# EAGLE design echidna-v0.81 (EAGLE 9.6.2)

## Sheet 1 of 2
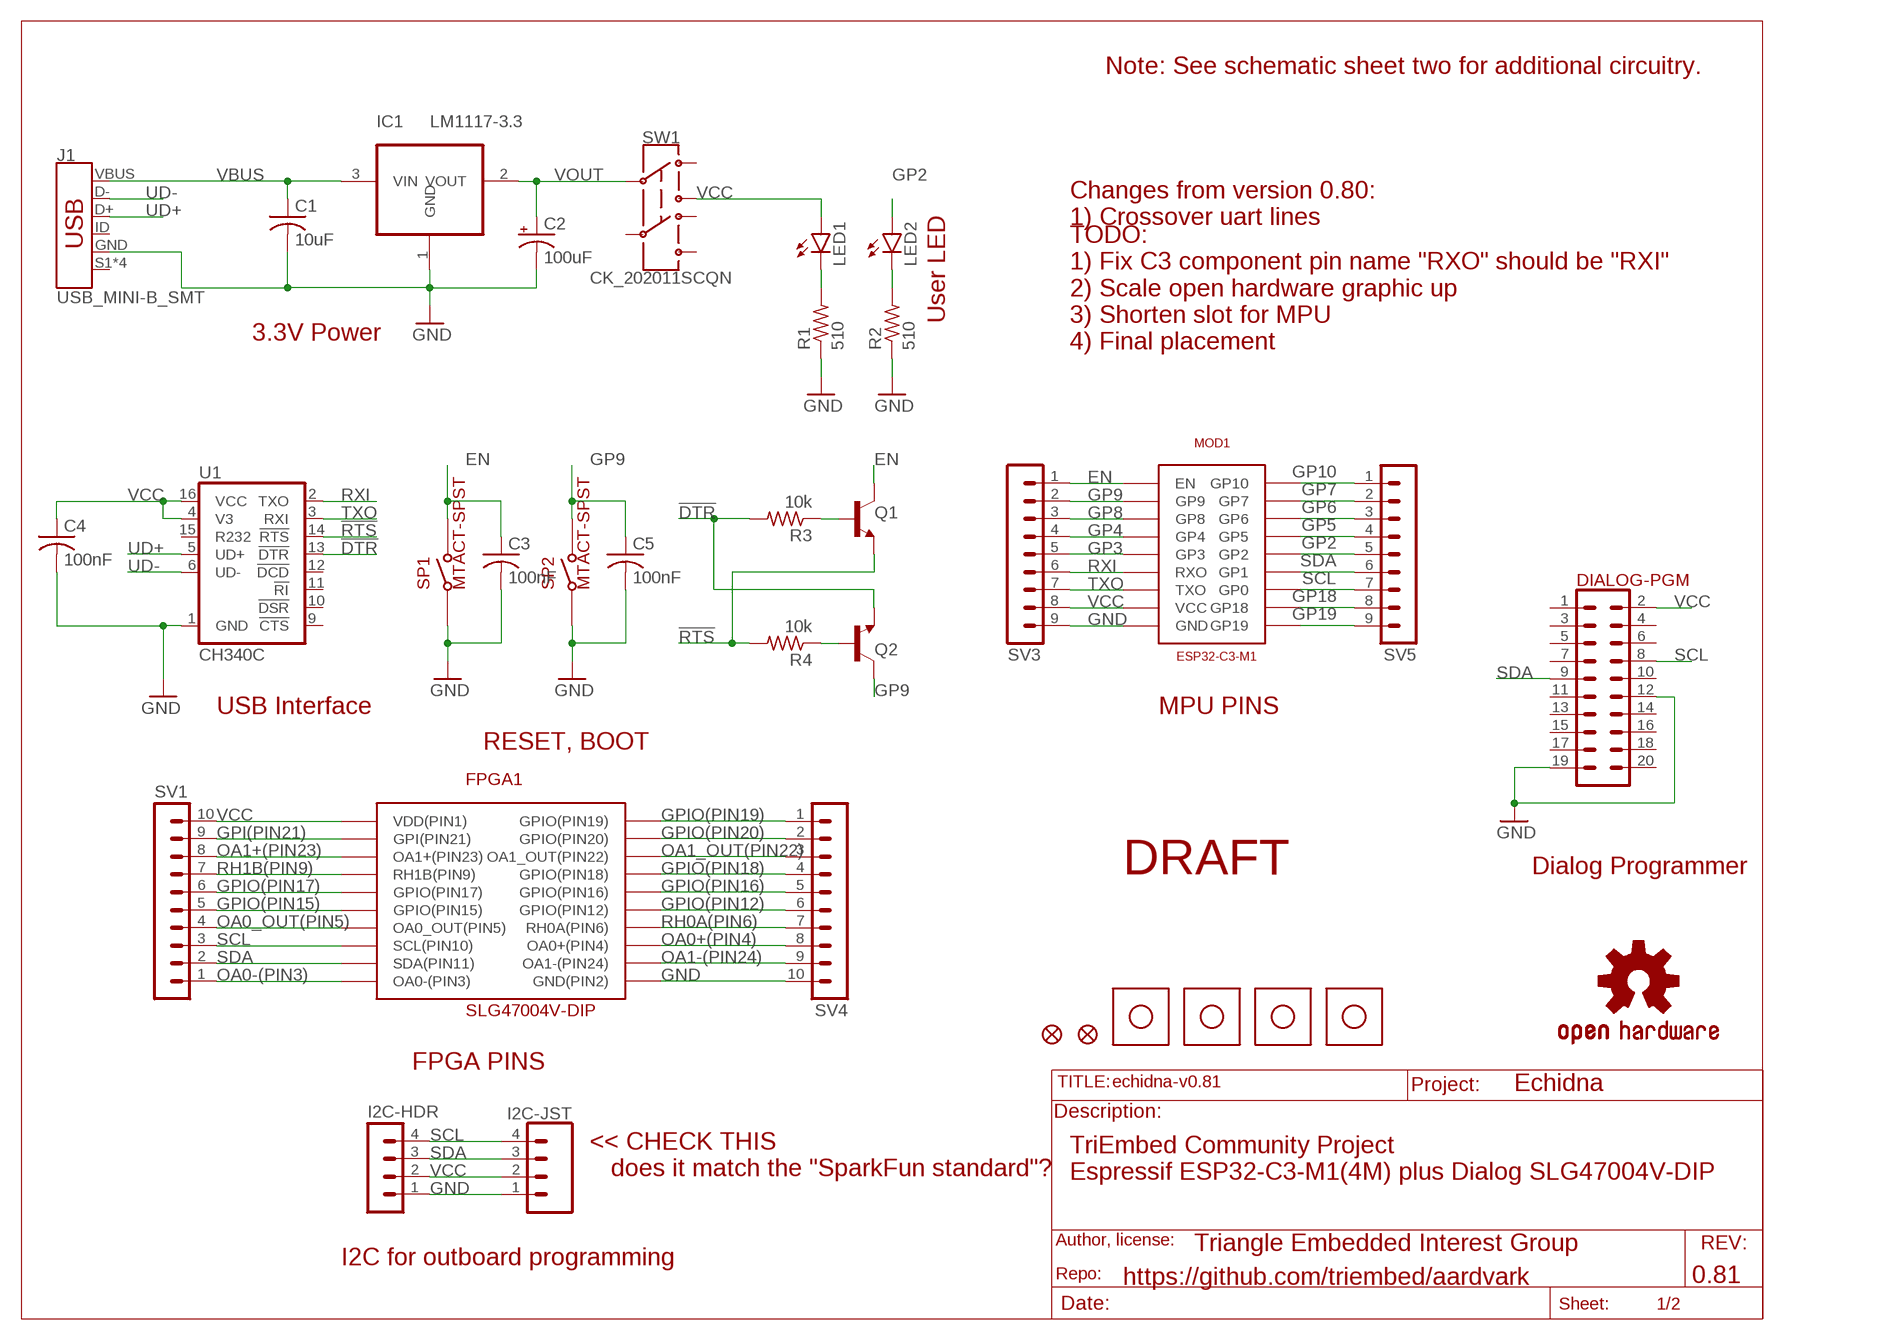
[diagram p0: schematic, sheet 1]

### Parts
C1  10uF  C-USC0805  [C0805]
C2  100uF  47UF-POLAR-PANASONIC_D-50V-20%  [PANASONIC_D]
C3  100nF  C-USC0805  [C0805]
C4  100nF  C-USC0805  [C0805]
C5  100nF  C-USC0805  [C0805]
DIALOG-PGM  CONN_10X2  [2X10]
FD1  FIDUCIAL1X2  [FIDUCIAL-1X2]
FD2  FIDUCIAL1X2  [FIDUCIAL-1X2]
FPGA1  SLG47004V-DIP  SLG47004V_DIP  [SLG47004V-DIP]
I2C-HDR  MA04-1  [MA04-1]
I2C-JST  CONN_04JST-PTH  [JST-4-PTH]
IC1  LM1117-3.3  REG1117  [SOT223]
J1  USB_MINI-B_SMT  [USB-MINIB]
LED1  LEDCHIP-LED0805  [CHIP-LED0805]
LED2  LEDCHIP-LED0805  [CHIP-LED0805]
LOGO1  OSHW-LOGOMINI  [OSHW-LOGO-MINI]
MOD1  ESP32-C3-M1  AITHINKER-C3-M1  [AITHINKER-C3-M1]
MT1  3.2-MOUNT  [3.2-MOUNT]
MT2  3.2-MOUNT  [3.2-MOUNT]
MT3  3.2-MOUNT  [3.2-MOUNT]
MT4  3.2-MOUNT  [3.2-MOUNT]
Q1  TRANS_NPN-MMBT2222AL  [SOT23-3]
Q2  TRANS_NPN-MMBT2222AL  [SOT23-3]
R1  510  R-US_R0805  [R0805]
R2  510  R-US_R0805  [R0805]
R3  10k  R-US_R0805  [R0805]
R4  10k  R-US_R0805  [R0805]
SP1  MTACT-SPST  [MTACTSPST]
SP2  MTACT-SPST  [MTACTSPST]
SV1  MA10-1  [MA10-1]
SV3  MA09-1  [MA09-1]
SV4  MA10-1  [MA10-1]
SV5  MA09-1  [MA09-1]
SW1  CK_202011SCQN  [CK_JS202011SCQN]
U1  CH340C  [SO016]

### Nets
!DTR: Q2.2(E) R3.2 U1.13(!DTR)
!RTS: Q1.2(E) R4.2 U1.14(!RTS)
EN: C3.1 MOD1.PIN1(EN) Q1.3(C) SP1.PAD2(PIN2) SV3.1
GND [power]: C1.2 C2.- C3.2 C4.2 C5.2 DIALOG-PGM.12 DIALOG-PGM.19 FPGA1.11(GND(PIN2)) I2C-HDR.1 I2C-JST.1 IC1.1(GND) J1.GND MOD1.PIN9(GND) R1.1 R2.1 SP1.PAD1(PIN1) SP2.PAD1(PIN1) SV3.9 SV4.10 U1.1(GND)
GP2: LED2.A MOD1.PIN14(GP2) SV5.5
GP3: MOD1.PIN5(GP3) SV3.5
GP4: MOD1.PIN4(GP4) SV3.4
GP5: MOD1.PIN15(GP5) SV5.4
GP6: MOD1.PIN16(GP6) SV5.3
GP7: MOD1.PIN17(GP7) SV5.2
GP8: MOD1.PIN3(GP8) SV3.3
GP9: C5.1 MOD1.PIN2(GP9) Q2.3(C) SP2.PAD2(PIN2) SV3.2
GP10: MOD1.PIN18(GP10) SV5.1
GP18: MOD1.PIN11(GP18) SV5.8
GP19: MOD1.PIN10(GP19) SV5.9
GPI(PIN21): FPGA1.2(GPI(PIN21)) SV1.9
GPIO(PIN12): FPGA1.15(GPIO(PIN12)) SV4.6
GPIO(PIN15): FPGA1.6(GPIO(PIN15)) SV1.5
GPIO(PIN16): FPGA1.16(GPIO(PIN16)) SV4.5
GPIO(PIN17): FPGA1.5(GPIO(PIN17)) SV1.6
GPIO(PIN18): FPGA1.17(GPIO(PIN18)) SV4.4
GPIO(PIN19): FPGA1.20(GPIO(PIN19)) SV4.1
GPIO(PIN20): FPGA1.19(GPIO(PIN20)) SV4.2
N$1: LED2.C R2.2
N$3: LED1.C R1.2
N$10: Q1.1(B) R3.1
N$11: Q2.1(B) R4.1
OA0+(PIN4): FPGA1.13(OA0+(PIN4)) SV4.8
OA0-(PIN3): FPGA1.10(OA0-(PIN3)) SV1.1
OA0_OUT(PIN5): FPGA1.7(OA0_OUT(PIN5)) SV1.4
OA1+(PIN23): FPGA1.3(OA1+(PIN23)) SV1.8
OA1-(PIN24): FPGA1.12(OA1-(PIN24)) SV4.9
OA1_OUT(PIN22): FPGA1.18(OA1_OUT(PIN22)) SV4.3
RH0A(PIN6): FPGA1.14(RH0A(PIN6)) SV4.7
RH1B(PIN9): FPGA1.4(RH1B(PIN9)) SV1.7
RXI: MOD1.PIN6(RXO) SV3.6 U1.2(TXO)
SCL: DIALOG-PGM.8 FPGA1.8(SCL(PIN10)) I2C-HDR.4 I2C-JST.4 MOD1.PIN12(GP0) SV1.3 SV5.7
SDA: DIALOG-PGM.9 FPGA1.9(SDA(PIN11)) I2C-HDR.3 I2C-JST.3 MOD1.PIN13(GP1) SV1.2 SV5.6
TXO: MOD1.PIN7(TXO) SV3.7 U1.3(RXI)
UD+: J1.D+ U1.5(UD+)
UD-: J1.D- U1.6(UD-)
VBUS [power]: C1.1 IC1.3(VIN) J1.VBUS
VCC [power]: C4.1 DIALOG-PGM.2 FPGA1.1(VDD(PIN1)) I2C-HDR.2 I2C-JST.2 LED1.A MOD1.PIN8(VCC) SV1.10 SV3.8 SW1.1-NO U1.4(V3) U1.16(VCC)
VOUT [power]: C2.+ IC1.2(VOUT) SW1.1-C(C1)
Unconnected: DIALOG-PGM.1 DIALOG-PGM.3 DIALOG-PGM.4 DIALOG-PGM.5 DIALOG-PGM.6 DIALOG-PGM.7 DIALOG-PGM.10 DIALOG-PGM.11 DIALOG-PGM.13 DIALOG-PGM.14 DIALOG-PGM.15 DIALOG-PGM.16 DIALOG-PGM.17 DIALOG-PGM.18 DIALOG-PGM.20 J1.ID J1.S1(SHIELD) J1.S2(SHIELD) J1.S3(SHIELD) J1.S4(SHIELD) SW1.1-NC SW1.2-C(C2) SW1.2-NC SW1.2-NO U1.9(!CTS) U1.10(!DSR) U1.11(!RI) U1.12(!DCD) U1.15(R232)

### Notes on the sheet
- Note: See schematic sheet two for additional circuitry.
- Changes from version 0.80:
  1) Crossover uart lines
- User LED
- 3.3V Power
- TODO:
  1) Fix C3 component pin name "RXO" should be "RXI"
  2) Scale open hardware graphic up
  3) Shorten slot for MPU
  4) Final placement
- USB Interface | MPU PINS
- RESET, BOOT
- DRAFT | Dialog Programmer
- FPGA PINS
- Echidna
- << CHECK THIS
     does it match the "SparkFun standard"?
- TriEmbed Community Project
  Espressif ESP32-C3-M1(4M) plus Dialog SLG47004V-DIP
- Triangle Embedded Interest Group
- I2C for outboard programming
- https://github.com/triembed/aardvark | 0.81

## Sheet 2 of 2
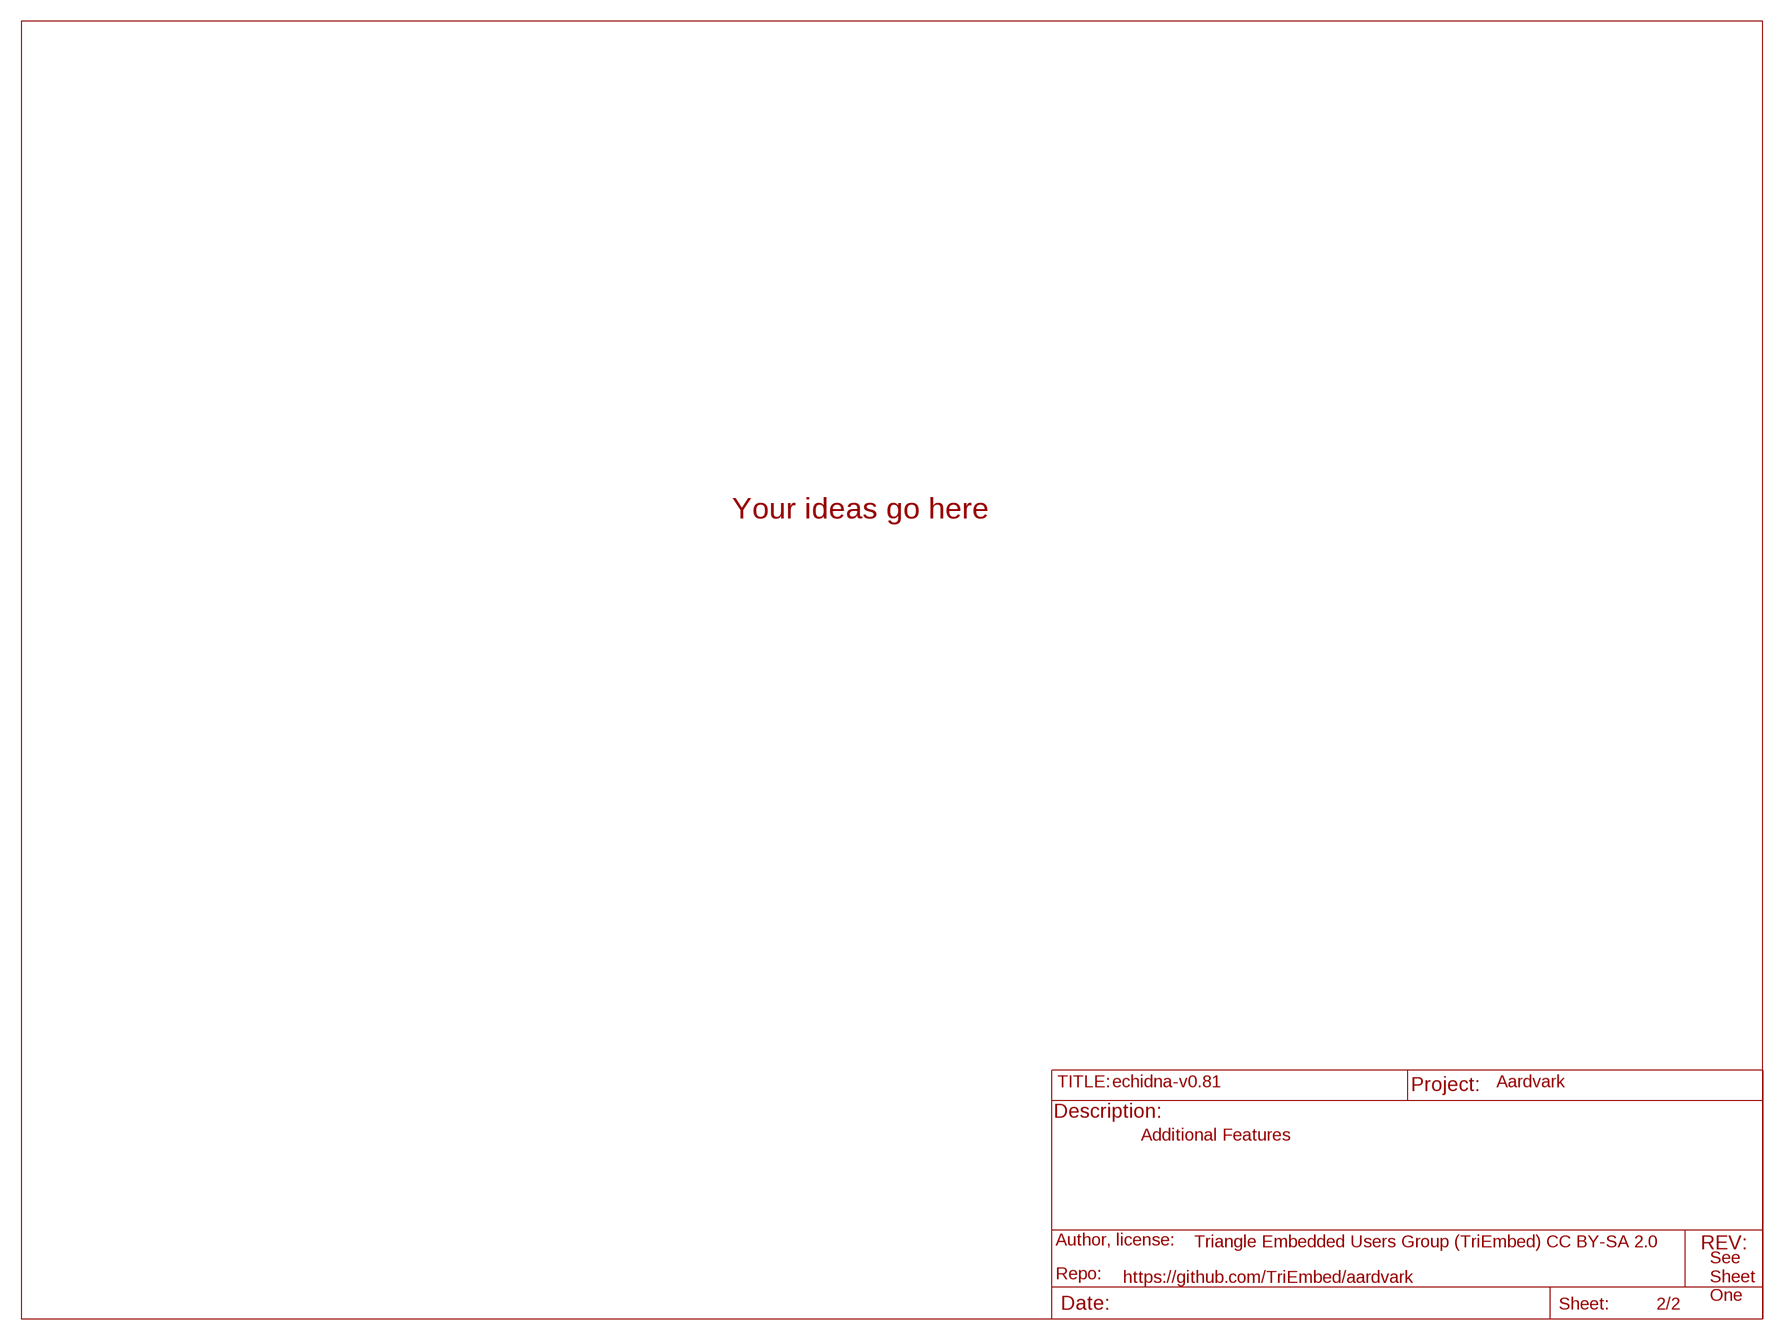
[diagram p1: schematic, sheet 2]

### Notes on the sheet
- Your ideas go here
- Aardvark
- Additional Features
- Triangle Embedded Users Group (TriEmbed) CC BY-SA 2.0
- https://github.com/TriEmbed/aardvark
- See
  Sheet
  One

## Library data of the parts
C1 C3-C5 = rcl:C-US: CAPACITOR, American symbol; SPICEPREFIX: C
C2 = SparkFun-Capacitors:47UF-POLAR: 47µF polarized capacitors A capacitor is a passive two-terminal electrical component used to store electrical energy temporarily in an electric field.
DIALOG-PGM = SparkFun-Connectors:CONN_10X2: Multi connection point. Often used as Generic Header-pin footprint for 0.1 inch spaced/style header connections On any of the 0.1 inch spaced packages, you can populate with these: Break Away Headers - Straight <https://www.sparkfun.com/products/116> (PRT-00116) Break Away Male Headers - Right Angle <https://www.sparkfun.com/products/553> (PRT-00553) Female Headers <https://www.sparkfun.com/products/115> (PRT-00115) Break Away Headers - Machine Pin <https://www.sparkfun.com/products/117> (PRT-00117) Break Away Female Headers - Swiss Machine Pin <https://www.sparkfun.com/products/743> (PRT-00743) Special note about the "SPECIAL" package: This was SPECIALLY designed to be used with our Graphic LCD Backpack. Be sure you want to use this! It is not only staggered on each line of header holes, but IT IS ALSO offset of the center point of the top and bottom lines by 5 mil. This causes the headers to lock into place on the "standard" footprint on the LCD screen. The extra squares on the tdocu layer are there simply to reference other pins (if you were to actually populate a longer header than ten long - this is what we do with the backpacks).
FD1 FD2 = apexprotofactory:FIDUCIAL: Fiducial Alignment Points Derived from SparkFun library but with cream (paste) included in pad. This is necessary for stencil creation by OSH Stencils!!
FPGA1 = SLG47004V-DIP:SLG47004V_DIP
I2C-HDR = con-lstb:MA04-1: PIN HEADER; OC_FARNELL: unknown; OC_NEWARK: unknown
I2C-JST = SparkFun-Connectors:CONN_04: Multi connection point. Often used as Generic Header-pin footprint for 0.1 inch spaced/style header connections On any of the 0.1 inch spaced packages, you can populate with these: Break Away Headers - Straight <https://www.sparkfun.com/products/116> (PRT-00116) Break Away Male Headers - Right Angle <https://www.sparkfun.com/products/553> (PRT-00553) Female Headers <https://www.sparkfun.com/products/115> (PRT-00115) Break Away Headers - Machine Pin <https://www.sparkfun.com/products/117> (PRT-00117) Break Away Female Headers - Swiss Machine Pin <https://www.sparkfun.com/products/743> (PRT-00743) For SCREWTERMINALS and SPRING TERMINALS visit here: Screw Terimnals on SparkFun.com <https://www.sparkfun.com/search/results?term=Screw+Terminals> (5mm/3.5mm/2.54mm spacing) This device is also useful as a general connection point to wire up your design to another part of your project. Our various solder wires solder well into these plated through hole pads. Hook-Up Wire - Assortment (Stranded, 22 AWG) <https://www.sparkfun.com/products/11375> (PRT-11375) Hook-Up Wire - Assortment (Solid Core, 22 AWG) <https://www.sparkfun.com/products/11367> (PRT-11367) View the entire wire category on our website here <https://www.sparkfun.com/categories/141> Special notes: Molex polarized connector foot print use with SKU : PRT-08231 with associated crimp pins and housings. 1MM SMD Version SKU: PRT-10208; PROD_ID: WIRE-13531; SF_ID: PRT-09916
IC1 = burr-brown:REG1117: 800mA and 1A Low Dropout (LDO) Positive Regulator 1.8V, 2.5V, 2.85V, 3.3V, 5V, and Adj; MPN: REG1117; OC_FARNELL: 1097566; OC_NEWARK: 14P6981
J1 = SparkFun-Connectors:USB_MINI-B: USB type Mini-B Connector Breaks out 5th pin, and includes shield pins if needed. SparkFun Products: SparkFun FTDI Basic Breakout <https://www.sparkfun.com/products/9716> SparkFun XBee Explorer USB <https://www.sparkfun.com/products/11812> SparkFun Redboard <https://www.sparkfun.com/products/12757>; PROD_ID: CONN-08193; SF_ID: PRT-00587
LED1 LED2 = led:LED: LED OSRAM: - CHIPLED LG R971, LG N971, LY N971, LG Q971, LY Q971, LO R971, LY R971 LH N974, LH R974 LS Q976, LO Q976, LY Q976 LO Q996 - Hyper CHIPLED LW Q18S LB Q993, LB Q99A, LB R99A - SideLED LS A670, LO A670, LY A670, LG A670, LP A670 LB A673, LV A673, LT A673, LW A673 LH A674 LY A675 LS A676, LA A676, LO A676, LY A676, LW A676 LS A679, LY A679, LG A679 - Hyper Micro SIDELED® LS Y876, LA Y876, LO Y876, LY Y876 LT Y87S - SmartLED LW L88C, LW L88S LB L89C, LB L89S, LG L890 LS L89K, LO L89K, LY L89K LS L896, LA L896, LO L896, LY L896 - TOPLED LS T670, LO T670, LY T670, LG T670, LP T670 LSG T670, LSP T670, LSY T670, LOP T670, LYG T670 LG T671, LOG T671, LSG T671 LB T673, LV T673, LT T673, LW T673 LH T674 LS T676, LA T676, LO T676, LY T676, LB T676, LH T676, LSB T676, LW T676 LB T67C, LV T67C, LT T67C, LS T67K, LO T67K, LY T67K, LW E67C LS E67B, LA E67B, LO E67B, LY E67B, LB E67C, LV E67C, LT E67C LW T67C LS T679, LY T679, LG T679 LS T770, LO T770, LY T770, LG T770, LP T770 LB T773, LV T773, LT T773, LW T773 LH T774 LS E675, LA E675, LY E675, LS T675 LS T776, LA T776, LO T776, LY T776, LB T776 LHGB T686 LT T68C, LB T68C - Hyper Mini TOPLED® LB M676 - Mini TOPLED Santana® LG M470 LS M47K, LO M47K, LY M47K Source: http://www.osram.convergy.de LUXEON: - LUMILED® LXK2-PW12-R00, LXK2-PW12-S00, LXK2-PW14-U00, LXK2-PW14-V00 LXK2-PM12-R00, LXK2-PM12-S00, LXK2-PM14-U00 LXK2-PE12-Q00, LXK2-PE12-R00, LXK2-PE12-S00, LXK2-PE14-T00, LXK2-PE14-U00 LXK2-PB12-K00, LXK2-PB12-L00, LXK2-PB12-M00, LXK2-PB14-N00, LXK2-PB14-P00, LXK2-PB14-Q00 LXK2-PR12-L00, LXK2-PR12-M00, LXK2-PR14-Q00, LXK2-PR14-R00 LXK2-PD12-Q00, LXK2-PD12-R00, LXK2-PD12-S00 LXK2-PH12-R00, LXK2-PH12-S00 LXK2-PL12-P00, LXK2-PL12-Q00, LXK2-PL12-R00 Source: www.luxeon.com KINGBRIGHT: KA-3528ASYC Source: www.kingbright.com
LOGO1 = SparkFun-Aesthetics:OSHW-LOGO: Open-Source Hardware (OSHW) Logo This logo indicates the piece of hardware it is found on incorporates a OSHW license and/or adheres to the definition of open source hardware found here: http://freedomdefined.org/OSHW
MOD1 = aithinker-C3-M1:AITHINKER-C3-M1: ESPRESSIF ESP32 C3 M1 module from AI Thinker
MT1-MT4 = apexprotofactory:3.2-MOUNT
Q1 Q2 = SparkFun-DiscreteSemi:TRANS_NPN: NPN transistor Current controlled devices typically used to amplify current or used as a switch. BC547 - COM-08928 <http://www.sparkfun.com/products/8928> (TO-92 45V 100mA) (1.Collector 2.Base 3.Emitter) 2N3904 - COM-00521 <http://www.sparkfun.com/products/521> (TO-92 40V 200mA) (1.Emitter 2.Base 3.Collector) P2N2222A - COM-12852 <http://www.sparkfun.com/products/12852> (TO-92 40V 600mA) (1.Collector 2.Base 3.Emitter); PROD_ID: TRANS-08049; VALUE: 600mA/40V
R1-R4 = rcl:R-US_: RESISTOR, American symbol; SPICEPREFIX: R
SP1 SP2 = CK-ATS2D1G_NC_LFS:MTACT-SPST: C&K ATS series momentary contact SPST pushbutton switch
SV1 SV4 = con-lstb:MA10-1: PIN HEADER; OC_FARNELL: unknown; OC_NEWARK: unknown
SV3 SV5 = con-lstb:MA09-1: PIN HEADER; OC_FARNELL: unknown; OC_NEWARK: unknown
SW1 = CK_JS202011SCQN:CK_202011SCQN
U1 = SparkFun-IC-Comms:CH340C; PROD_ID: IC-14038

## Net classes
0 default: width 0.203 mm
1 power: width 0.508 mm

## Board
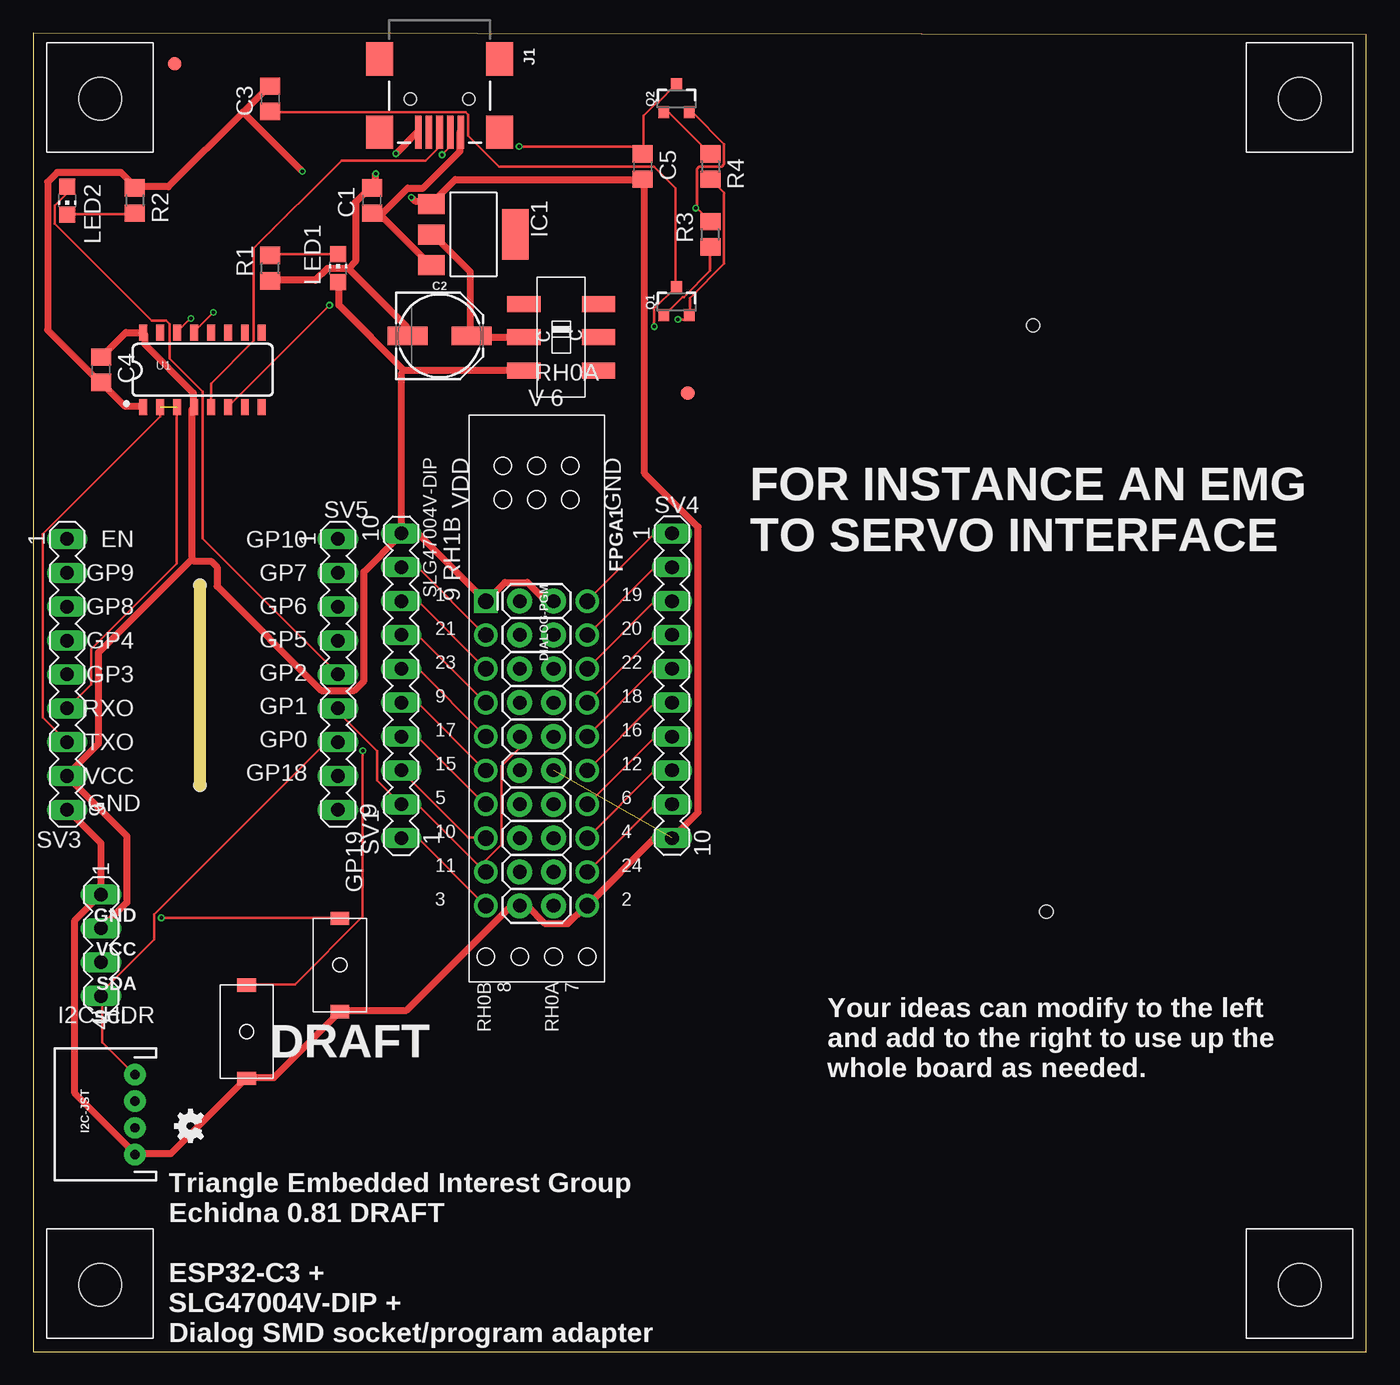
[diagram p2: board, top side]
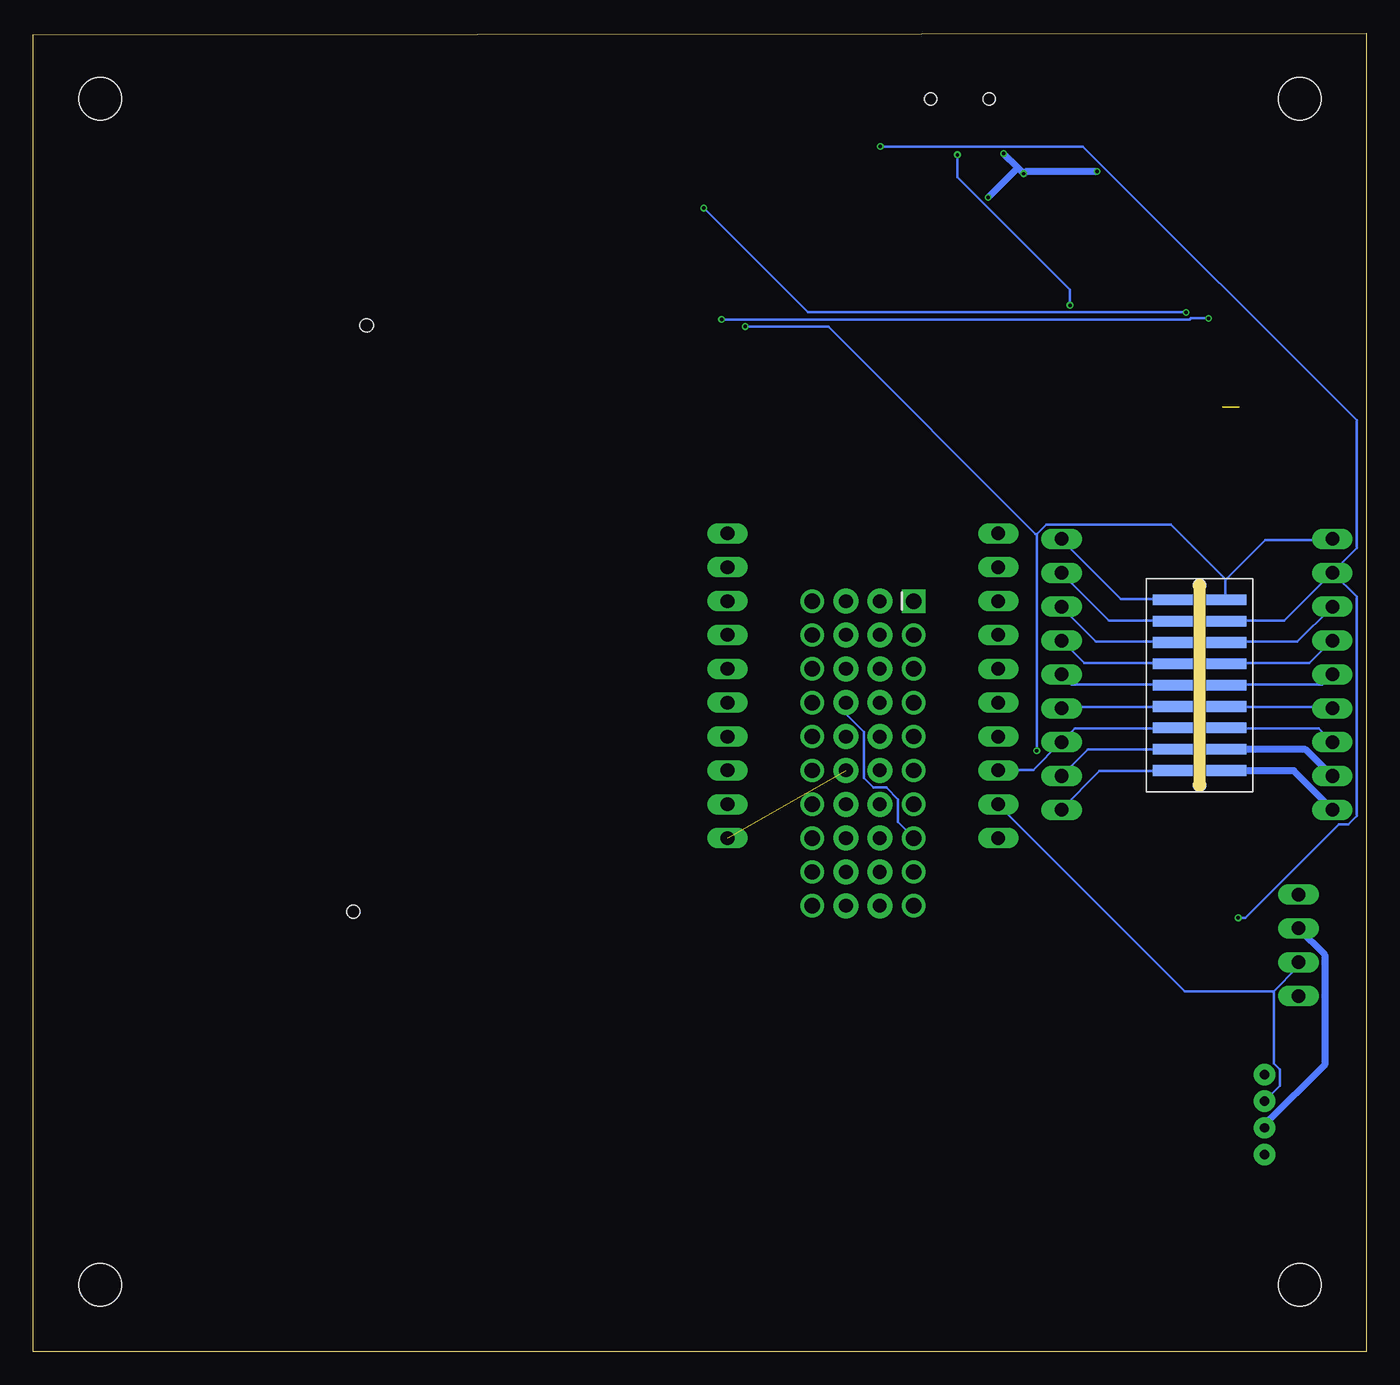
[diagram p3: board, bottom side, seen from below]

Size 100 x 98.9 mm. Coordinates in mm from the lower left corner, seen from the top.
Outline: 0,0 100,0 100,98.8 0,98.9 0,0
Copper layers (1*16): Top 0.035559375mm / dielectric 1.6mm / Bottom 0.035559375mm
Design rules "oshpark-2layer": minimum track width 6mil, minimum drill 10mil, track to track 6mil, track to pad 6mil, pad to pad 6mil, via to via 6mil, smd to smd 6mil, copper to edge 15mil, drill to drill 6mil, minimum pad ring 5mil, minimum via ring 5mil, stop-mask expansion 2.5mil, vias tented up to drill 0mil, thermal gap 10mil
Holes 1 mm at 75,77 76,33

### Footprints (pad centres in the part's own frame; a part is rotated, then mirrored left to right if it is on the bottom)
C0805 = smd 1.3 x 1.5: 1 -0.95,0; 2 0.95,0
PANASONIC_D = smd 3 x 1.4: + 2.4,0; - -2.4,0
2X10 = drill 1.016 pad 1.88: 1 0,0; 2 0,2.54; 3 2.54,0; 4 2.54,2.54; 5 5.08,0; 6 5.08,2.54; 7 7.62,0; 8 7.62,2.54; 9 10.16,0; 10 10.16,2.54; 11 12.7,0; 12 12.7,2.54; 13 15.24,0; 14 15.24,2.54; 15 17.78,0; 16 17.78,2.54; 17 20.32,0; 18 20.32,2.54; 19 22.86,0; 20 22.86,2.54
FIDUCIAL-1X2 = smd 1 x 1: 1 0,0
SLG47004V-DIP = drill 1.15 pad 1.75 square: 1 -5.08,-3.81 | drill 1.15 pad 1.75: 2 -2.54,-3.81; 3 0,-3.81; 4 2.54,-3.81; 5 5.074,-3.81; 6 7.62,-3.81; 7 10.16,-3.81; 8 12.7,-3.81; 9 15.24,-3.81; 10 17.78,-3.81; 11 17.78,3.81; 12 15.24,3.81; 13 12.7,3.81; 14 10.16,3.81; 15 7.62,3.81; 16 5.08,3.81; 17 2.54,3.81; 18 0,3.81; 19 -2.54,3.81; 20 -5.08,3.81
MA04-1 = drill 1.016 long: 1 -3.81,0; 2 -1.27,0; 3 1.27,0; 4 3.81,0
JST-4-PTH = drill 0.7 pad 1.6: 1 -3,0; 2 -1,0; 3 1,0; 4 3,0
SOT223 = smd 1.499 x 2.007: 1 -2.261,-3.15; 2 0.025,-3.15; 3 2.311,-3.15 | smd 3.81 x 2.007: 4 0,3.15
USB-MINIB = smd 2.5 x 0.5: D+ 2.5,0; D- 2.5,0.8; GND 2.5,-1.6; ID 2.5,-0.8; VBUS 2.5,1.6 | smd 2.5 x 2: S1 -3,4.5; S2 2.5,4.5; S3 -3,-4.5; S4 2.5,-4.5 | hole 0.9: 0,2.2; 0,-2.2
CHIP-LED0805 = smd 1.2 x 1.2: A 0,-1.05; C 0,1.05
AITHINKER-C3-M1 = smd 0.8 x 3 bottom: PIN1 -6.4,-2; PIN2 -4.8,-2; PIN3 -3.2,-2; PIN4 -1.6,-2; PIN5 0,-2; PIN6 1.6,-2; PIN7 3.2,-2; PIN8 4.8,-2; PIN9 6.4,-2; PIN10 6.4,2; PIN11 4.8,2; PIN12 3.2,2; PIN13 1.6,2; PIN14 0,2; PIN15 -1.6,2; PIN16 -3.2,2; PIN17 -4.8,2; PIN18 -6.4,2 | hole 0.9: -7.5,0; 7.5,0
3.2-MOUNT = hole 3.2: 0,0
SOT23-3 = smd 0.8 x 0.9: 1 -0.95,-1; 2 0.95,-1; 3 0,1.1
R0805 = smd 1.3 x 1.5: 1 -0.95,0; 2 0.95,0
MTACTSPST = smd 1 x 1.4: PAD1 -3.5,0; PAD2 3.5,0
MA10-1 = drill 1.016 long: 1 -11.43,0; 2 -8.89,0; 3 -6.35,0; 4 -3.81,0; 5 -1.27,0; 6 1.27,0; 7 3.81,0; 8 6.35,0; 9 8.89,0; 10 11.43,0
MA09-1 = drill 1.016 long: 1 -10.16,0; 2 -7.62,0; 3 -5.08,0; 4 -2.54,0; 5 0,0; 6 2.54,0; 7 5.08,0; 8 7.62,0; 9 10.16,0
CK_JS202011SCQN = smd 1.2 x 2.5: 1-C -0.9,2.3; 1-NC 1.6,2.3; 1-NO -3.4,2.3; 2-C -0.9,-3.3; 2-NC 1.6,-3.3; 2-NO -3.4,-3.3
SO016 = smd 0.6 x 1.2: 1 -4.445,-2.8; 2 -3.175,-2.8; 3 -1.905,-2.8; 4 -0.635,-2.8; 5 0.635,-2.8; 6 1.905,-2.8; 7 3.175,-2.8; 8 4.445,-2.8; 9 4.445,2.8; 10 3.175,2.8; 11 1.905,2.8; 12 0.635,2.8; 13 -0.635,2.8; 14 -1.905,2.8; 15 -3.175,2.8; 16 -4.445,2.8

### Placement (x,y rotation side)
C1  25.4,86.36 90 top
C2  30.48,76.2 0 top
C3  17.78,93.98 90 top
C4  5.08,73.66 270 top
C5  45.72,88.9 270 top
DIALOG-PGM  36.49,56.3 270 top
FD1  10.6,96.62 270 top
FD2  49.1,71.9 0 top
FPGA1  37.76,51.22 270 top
I2C-HDR  5.08,30.48 270 top
I2C-JST  7.62,17.78 90 top
IC1  33.02,83.82 270 top
J1  30.48,93.98 270 top
LED1  22.86,81.28 0 top
LED2  2.54,86.36 180 top
LOGO1  11.78,16.92 90 top
MOD1  12.5,50 270 top
MT1  95,5 0 top
MT2  5,5 0 top
MT3  95,94 0 top
MT4  5,94 0 top
Q1  48.26,78.74 0 top
Q2  48.26,93.98 0 top
R1  17.78,81.28 90 top
R2  7.62,86.36 270 top
R3  50.8,83.82 90 top
R4  50.8,88.9 270 top
SP1  16,24 90 top
SP2  23,29 90 top
SV1  27.6,49.95 90 top
SV3  2.54,50.8 270 top
SV4  47.92,49.95 270 top
SV5  22.86,50.8 270 top
SW1  39.1,77 90 top
U1  12.7,73.66 0 top

### Tracks (layer width: path | path; a pad name or v marks a point on that pad's centre or on a via)
!DTR  (via drill 0.25)
  Top 0.203: 49.78,85.79 49.78,88.72 49.96,88.9 51.65,88.9 51.83,89.08 51.83,90.59 49.52,92.9 49.25,92.9 Q2.2 | 49.78,85.79 50.76,84.81 R3.2 | v13.51,77.97 12.09,76.54 U1.13 | v49.7,85.79 49.78,85.79
  Bottom 0.203: v13.51,77.97 41.87,77.97 v49.7,85.79
!RTS  (via drill 0.25)
  Top 0.203: R4.2 50.85,87.92 51.83,86.94 51.83,81.61 49.25,79.03 49.25,77.79 Q1.2 49.16,77.7 48.9,77.43 v48.36,77.43 | v11.82,77.52 10.85,76.54 U1.14
  Bottom 0.203: v11.82,77.52 13.16,77.52 13.25,77.43 v48.36,77.43
EN  (via drill 0.25)
  Top 0.203: C3.1 17.78,92.99 32.45,92.99 32.63,92.81 32.63,91.21 34.94,88.9 46.58,88.9 48.18,87.3 48.18,79.92 Q1.3 48.18,79.83 46.58,78.23 v46.58,76.9 | v24.71,45.07 24.71,32.63 19.65,27.56 16,27.56 SP1.PAD2
  Bottom 0.203: 24.71,61.34 v24.71,45.07 | 24.71,61.34 24,62.05 14.67,62.05 10.58,57.96 | 10.58,57.96 10.58,56.45 MOD1.PIN1 | SV3.1 2.58,60.9 7.56,60.9 10.49,57.96 10.58,57.96 | v46.58,76.9 40.36,76.9 24.8,61.34 24.71,61.34
GND  (via drill 0.25)  (1 unrouted)
  Top 0.508: U1.1 8.18,70.94 6.84,70.94 5.16,72.63 C4.2 4.89,72.81 1.07,76.63 1.07,87.74 1.78,88.46 6.58,88.46 7.47,87.57 R2.1 7.64,87.39 10.13,87.39 15.73,92.99 | 15.73,92.99 17.6,94.86 17.78,94.86 C3.2 | 23.65,81.25 22.05,81.25 21.16,80.37 17.78,80.37 R1.1 | 23.65,81.25 24.18,81.79 24.18,86.23 25.34,87.39 C1.2 25.51,87.57 25.69,87.74 v25.69,88.37 | v27.2,89.88 28.8,91.48 J1.GND | 23.65,81.25 28,76.9 28,76.28 C2.- | v28.36,86.59 28.63,86.32 29.69,86.32 IC1.1 29.87,86.14 31.65,87.92 45.7,87.92 C5.2 45.87,87.74 45.87,65.88 49.87,61.87 49.87,40.45 48.09,38.67 SV4.10 47.92,38.49 46.58,38.49 41.6,33.52 FPGA1.11 41.34,33.34 40.09,32.09 38.41,32.09 37.07,33.43 36.54,33.43 DIALOG-PGM.19 36.27,33.34 35.74,33.34 28,25.6 23.2,25.6 SP2.PAD1 22.94,25.43 18.05,20.54 16,20.54 SP1.PAD1 15.82,20.36 10.31,14.85 7.64,14.85 I2C-JST.1 7.47,15.02 3.11,19.38 3.11,32.36 4.89,34.14 I2C-HDR.1 5.07,34.31 5.07,38.14 2.58,40.63 SV3.9 | v20.18,88.54 15.73,92.99
  Bottom 0.508: 26.14,88.81 v25.69,88.37 25.51,88.54 v20.18,88.54 | 26.14,88.81 v27.2,89.88 | 26.14,88.81 v28.36,86.59 | MOD1.PIN9 10.49,43.56 5.42,43.56 2.58,40.72 SV3.9
GP2
  Top 0.203: LED2.A 2.49,87.39 2.49,86.86 1.6,85.97 1.6,84.63 8.89,77.34 9.96,77.34 10.22,77.08 10.22,74.5 12.71,72.01 12.71,60.98 22.85,50.85 SV5.5
  Bottom 0.203: MOD1.PIN14 14.58,50.05 22.14,50.05 22.85,50.76 SV5.5
GP3
  Bottom 0.203: SV3.5 3.29,50.05 10.49,50.05 MOD1.PIN5
GP4
  Bottom 0.203: MOD1.PIN4 10.49,51.65 4.27,51.65 2.58,53.34 SV3.4
GP5
  Bottom 0.203: MOD1.PIN15 14.58,51.65 21.16,51.65 22.85,53.34 SV5.4
GP6
  Bottom 0.203: MOD1.PIN16 14.58,53.25 20.27,53.25 22.85,55.83 SV5.3
GP7
  Bottom 0.203: SV5.2 19.29,54.85 14.58,54.85 MOD1.PIN17
GP8
  Bottom 0.203: MOD1.PIN3 10.49,53.25 5.16,53.25 2.58,55.83 SV3.3
GP9  (via drill 0.25)
  Top 0.203: Q2.3 48.18,95.03 46.85,93.7 46.76,93.7 45.78,92.72 45.78,89.88 C5.1 45.7,90.41 v36.45,90.41 | v9.6,32.54 22.94,32.54 SP2.PAD2
  Bottom 0.203: v9.6,32.54 9.07,32.54 2.04,39.56 1.33,39.56 0.71,40.18 0.71,56.63 2.49,58.41 SV3.2 | MOD1.PIN2 10.49,54.85 6.13,54.85 2.58,58.41 SV3.2 | v36.45,90.41 21.25,90.41 0.71,69.88 0.71,60.27 2.49,58.5 SV3.2
GP10
  Bottom 0.203: MOD1.PIN18 14.58,56.45 18.4,56.45 22.85,60.9 SV5.1
GP18
  Bottom 0.203: MOD1.PIN11 14.58,45.16 20.89,45.16 22.85,43.2 SV5.8
GP19
  Bottom 0.203: MOD1.PIN10 14.58,43.56 20,43.56 22.85,40.72 SV5.9
GPI(PIN21)
  Top 0.203: SV1.9 27.65,58.76 28.89,58.76 33.87,53.78 FPGA1.2
GPIO(PIN12)
  Top 0.203: SV4.6 47.92,48.63 46.58,48.63 41.6,43.65 FPGA1.15
GPIO(PIN15)
  Top 0.203: SV1.5 27.65,48.63 28.89,48.63 33.87,43.65 FPGA1.6
GPIO(PIN16)
  Top 0.203: SV4.5 47.92,51.21 46.58,51.21 41.6,46.23 FPGA1.16
GPIO(PIN17)
  Top 0.203: SV1.6 27.65,51.21 28.89,51.21 33.87,46.23 FPGA1.5
GPIO(PIN18)
  Top 0.203: SV4.4 47.92,53.7 46.58,53.7 41.6,48.72 FPGA1.17
GPIO(PIN19)
  Top 0.203: SV4.1 47.92,61.34 46.58,61.34 41.6,56.36 FPGA1.20
GPIO(PIN20)
  Top 0.203: SV4.2 47.92,58.76 46.58,58.76 41.6,53.78 FPGA1.19
N$1
  Top 0.203: LED2.C 2.58,85.34 7.56,85.34 R2.2
N$3
  Top 0.203: LED1.C 22.85,82.32 17.87,82.32 R1.2
N$10
  Top 0.203: Q1.1 47.38,77.79 48.72,79.12 48.81,79.12 50.76,81.08 50.76,82.86 R3.1
N$11
  Top 0.203: Q2.1 47.38,92.9 47.74,92.9 50.76,89.88 R4.1
OA0+(PIN4)
  Top 0.203: SV4.8 47.92,43.56 46.58,43.56 41.6,38.58 FPGA1.13
OA0-(PIN3)
  Top 0.203: SV1.1 27.65,38.49 28.89,38.49 33.87,33.52 FPGA1.10
OA0_OUT(PIN5)
  Top 0.203: SV1.4 27.65,46.14 28.8,46.14 33.87,41.07 FPGA1.7
OA1+(PIN23)
  Top 0.203: SV1.8 27.65,56.27 28.89,56.27 33.87,51.3 FPGA1.3
OA1-(PIN24)
  Top 0.203: SV4.9 47.92,40.98 46.58,40.98 41.6,36.01 FPGA1.12
OA1_OUT(PIN22)
  Top 0.203: SV4.3 47.92,56.27 46.58,56.27 41.6,51.3 FPGA1.18
RH0A(PIN6)
  Top 0.203: SV4.7 46.67,46.14 41.6,41.07 FPGA1.14
RH1B(PIN9)
  Top 0.203: SV1.7 27.65,53.7 28.89,53.7 33.87,48.72 FPGA1.4
RXI  (1 unrouted)
  Top 0.203: 10.76,70.85 10.76,59.12 4.36,52.72 4.36,50.05 2.58,48.27 SV3.6
  Bottom 0.203: MOD1.PIN6 10.49,48.36 2.67,48.36 2.58,48.27 SV3.6
SCL
  Top 0.203: I2C-JST.4 7.56,20.8 5.16,23.2 5.16,26.67 I2C-HDR.4 5.16,26.76 5.16,27.03 9.07,30.94 9.07,32.8 21.96,45.7 22.85,45.7 SV5.7 | FPGA1.8 33.87,38.58 32.63,38.58 27.65,43.56 SV1.3
  Bottom 0.203: MOD1.PIN12 14.58,46.76 21.87,46.76 22.85,45.78 SV5.7 22.94,45.7 24.98,43.65 27.56,43.65 SV1.3 | DIALOG-PGM.8 39.03,48.63 39.03,47.83 37.69,46.49 37.69,43.03 36.98,42.32 36.01,42.32 35.12,41.43 35.12,39.74 33.96,38.58 FPGA1.8
SDA
  Top 0.203: DIALOG-PGM.9 36.45,46.14 36.45,45.25 35.12,43.92 35.12,38.05 33.52,36.45 FPGA1.9 33.87,36.01 28.89,40.98 27.65,40.98 SV1.2 27.56,41.07 25.78,42.85 25.78,45.07 22.94,47.92 22.94,48.18 SV5.6
  Bottom 0.203: 6.93,27.03 5.16,28.8 5.16,29.16 I2C-HDR.3 | 6.93,27.03 6.93,21.6 6.49,21.16 6.49,19.91 7.56,18.85 I2C-JST.3 | SV5.6 22.76,48.36 14.58,48.36 MOD1.PIN13 | 6.93,27.03 13.6,27.03 27.56,40.98 SV1.2
TXO  (1 unrouted)
  Top 0.203: 9.51,70.85 9.51,70.14 0.71,61.34 0.71,47.56 2.49,45.78 SV3.7
  Bottom 0.203: MOD1.PIN7 10.49,46.76 3.56,46.76 2.58,45.78 SV3.7
UD+
  Top 0.203: U1.5 13.34,72.63 16.54,75.83 16.54,82.77 23.11,89.34 29.43,89.34 30.4,90.32 30.4,91.48 J1.D+
UD-  (via drill 0.25)
  Top 0.203: v22.23,78.5 14.67,70.94 U1.6 | v30.67,89.79 31.2,90.32 31.2,91.48 J1.D-
  Bottom 0.203: v22.23,78.5 22.23,79.65 30.67,88.1 v30.67,89.79
VBUS
  Top 0.508: 26.05,85.25 29.87,81.43 IC1.3 | 26.05,85.25 25.96,85.34 25.43,85.34 C1.1 | 26.05,85.25 28.09,87.3 29.25,87.3 32,90.06 32,91.48 J1.VBUS
VCC
  Top 0.508: 27.83,73.61 22.94,78.5 22.94,80.19 LED1.A | 27.83,73.61 36.72,73.61 SW1.1-NO | SV1.10 27.65,61.34 28.89,61.34 33.87,56.36 FPGA1.1 34.14,56.45 35.38,57.7 37.07,57.7 38.41,56.36 39.03,56.36 DIALOG-PGM.2 | 27.83,73.61 27.65,73.43 27.65,61.61 SV1.10 | C4.1 5.16,74.68 6.93,76.45 8.18,76.45 U1.16 8.36,76.28 8.36,75.56 12,71.92 12,70.94 U1.4 11.91,70.67 11.91,59.47 | I2C-HDR.2 7.02,33.69 7.02,38.67 2.58,43.12 SV3.8 2.67,43.38 4.89,45.61 4.89,52.45 11.91,59.47 | SV1.10 27.47,61.16 24.8,58.5 24.8,50.32 24.09,49.61 21.6,49.61 13.78,57.43 13.78,58.85 13.34,59.3 12.09,59.3 11.91,59.47
  Bottom 0.508: MOD1.PIN8 10.49,45.16 4.53,45.16 2.58,43.2 SV3.8 | I2C-HDR.2 3.11,29.78 3.11,21.51 7.56,17.07 7.56,16.8 I2C-JST.2
VOUT
  Top 0.508: IC1.2 29.87,83.74 30.05,83.74 32.8,80.99 32.8,76.28 C2.+ 33.07,76.1 36.72,76.1 SW1.1-C

### Text on the board
tNames: EN | GP10 | FOR INSTANCE AN EMG / TO SERVO INTERFACE | GP9 | GP7 | GP8 | GP6 | GP4 | GP5 | GP3 | GP2 | RXO | GP1 | TXO | GP0 | VCC | GP18 | GND | GP19 | GND | VCC | SDA | SCL | DRAFT | Your ideas can modify to the left / and add to the right to use up the / whole board as needed. | Triangle Embedded Interest Group / Echidna 0.81 DRAFT / / ESP32-C3 + / SLG47004V-DIP + / Dialog SMD socket/program adapter